# EasyEDA schematic 1-Schematic_Final Assigment.json
TITLE: Sheet_1; REV: 1.0; Date: 2020-05-26; Sheet: 1/1; Drawn By: Lachlan_C; Company: Your Company
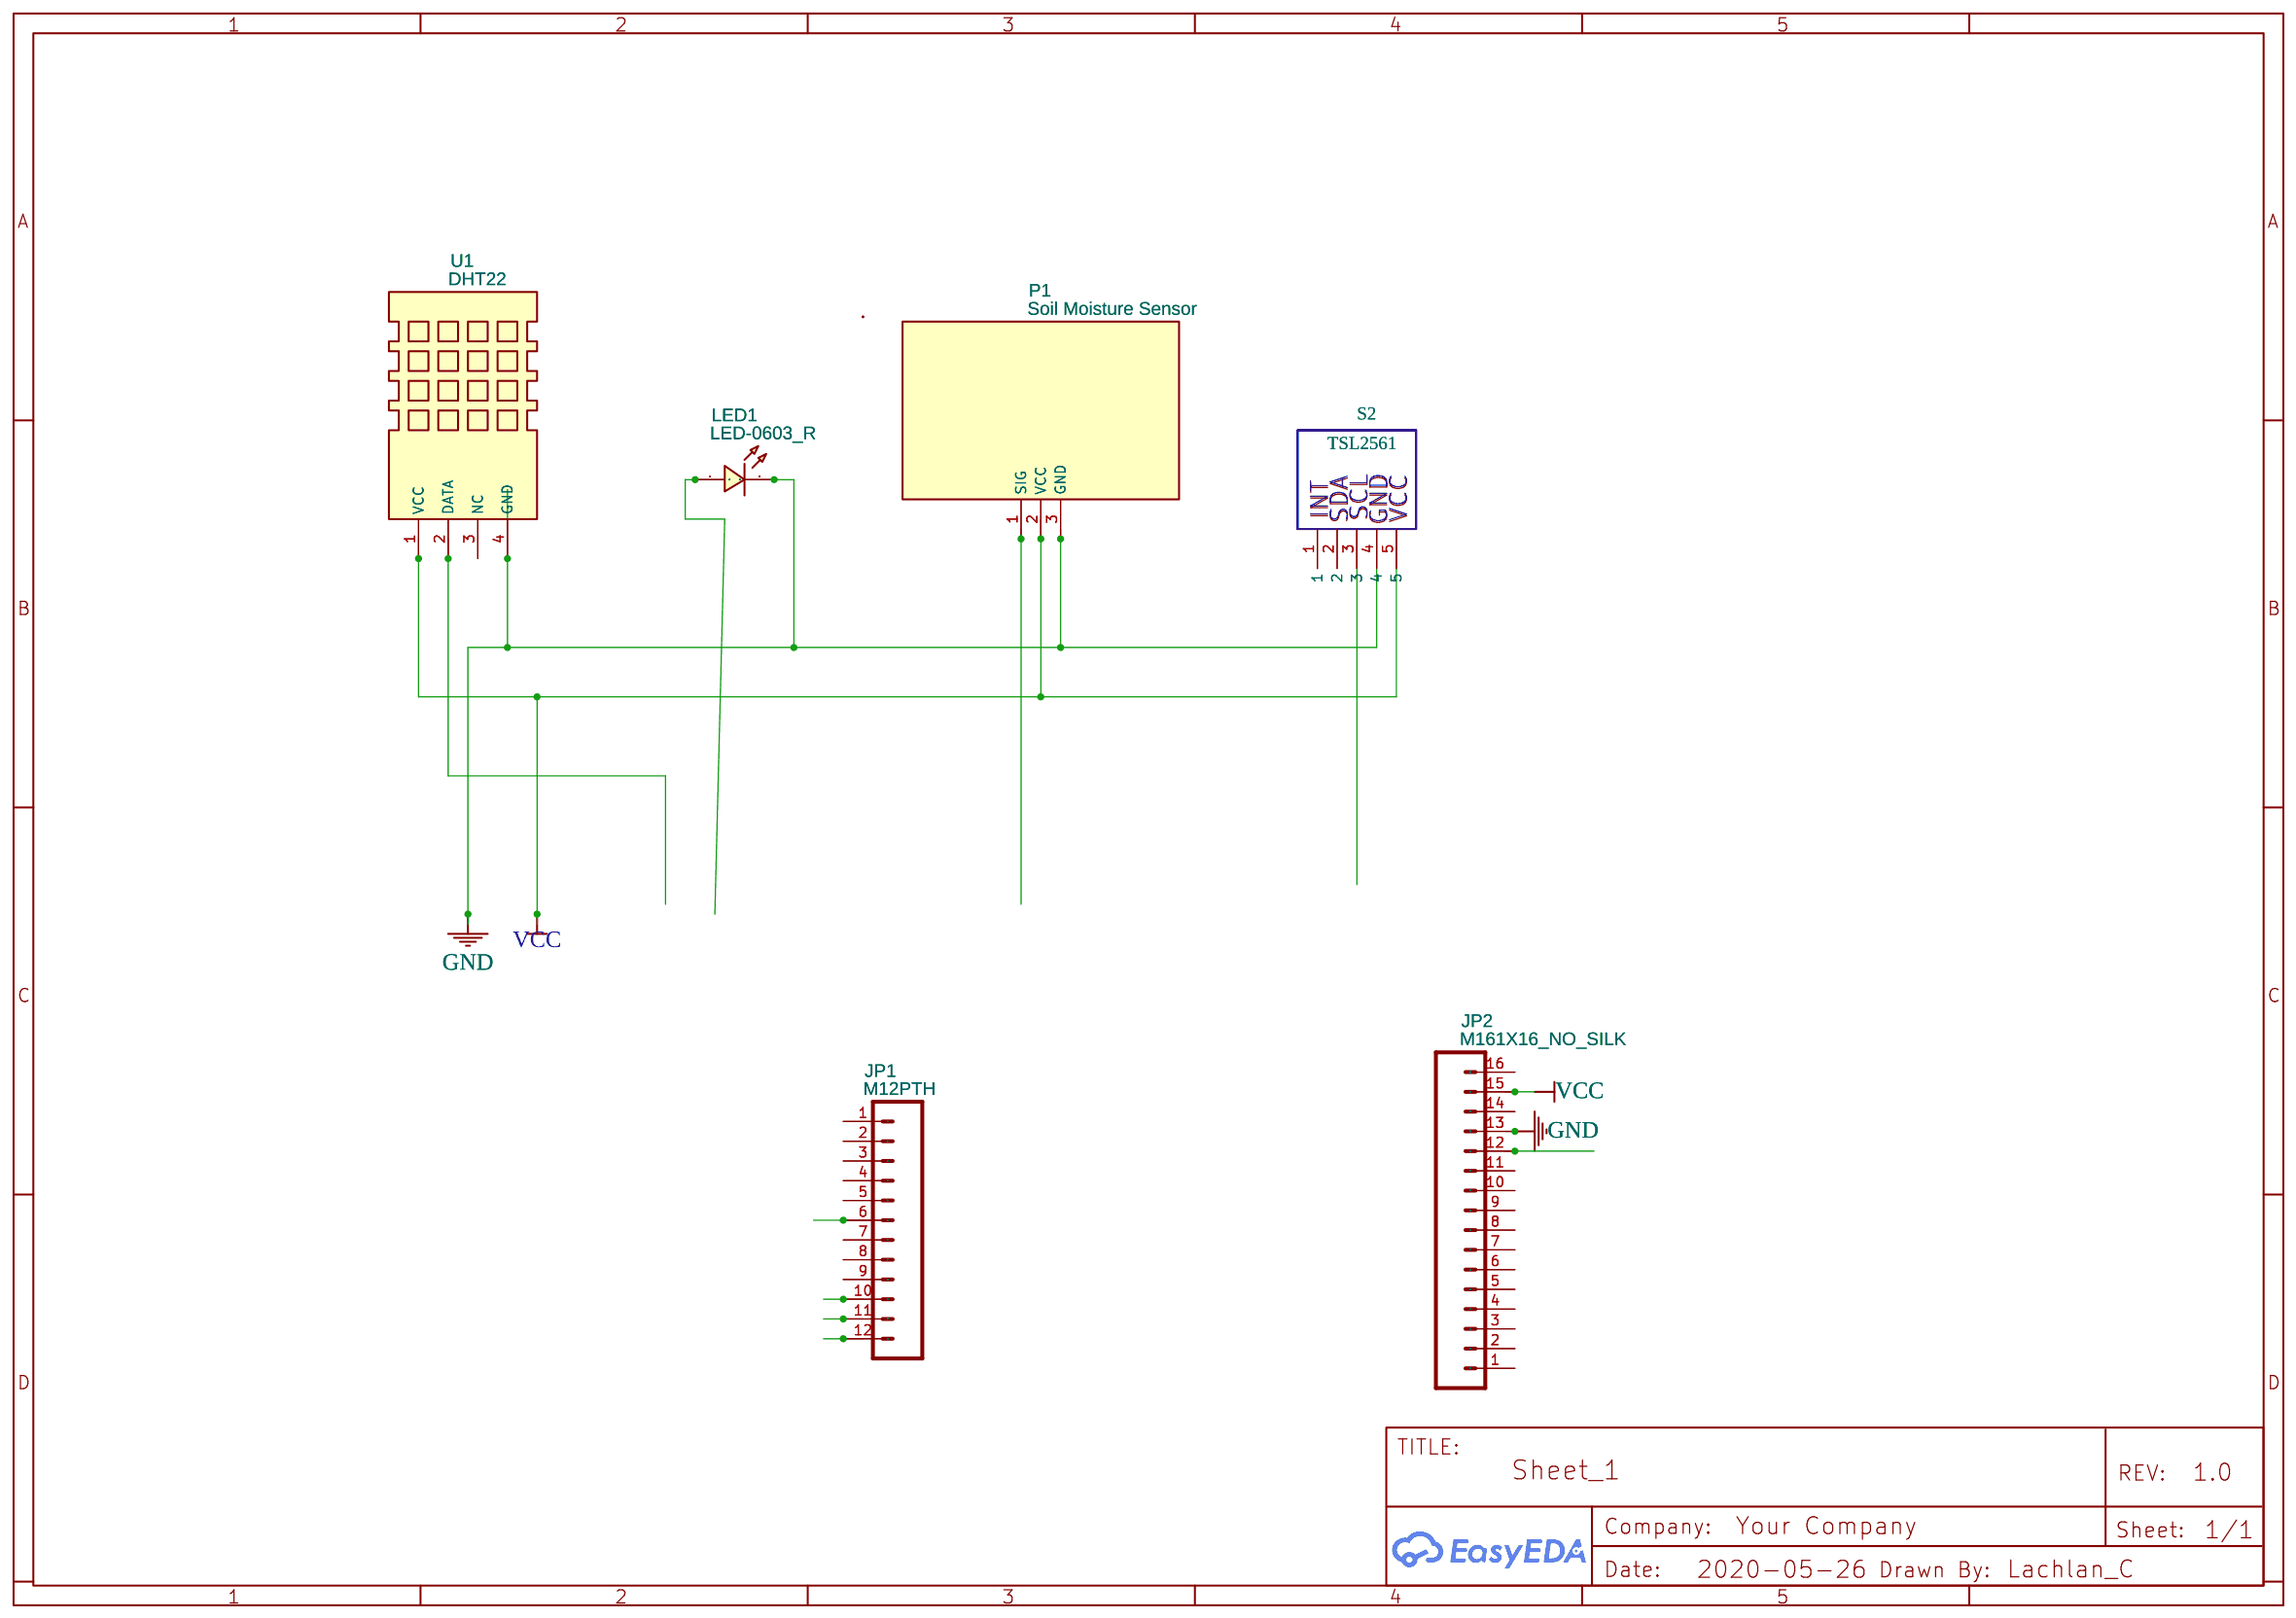
[diagram p0: schematic sheet]

## Parts
JP1  M12PTH  [1X12]
JP2  M161X16_NO_SILK  [1X16_NO_SILK]
LED1  LED-0603_R  [LED0603_RED]
P1  Soil Moisture Sensor  [SOIL MOISTURE SENSOR]
S2  TSL2561  [ADAFRUIT VEML7700 AMBIENT LIGHT SENSOR]
U1  DHT22  [DHT22_AM2303_VERT]

## Library data of the parts
JP1 = M12PTH: Header 12; Contributor: SparkFun
JP2 = M161X16_NO_SILK: 1x16 .1 header; Contributor: SparkFun
LED1 = LED-0603_R: Manufacturer: EVERLIGHT(台湾亿光); Manufacturer Part: 19-217/R6C-AL1M2VY/3T; Supplier Part: C72044; Supplier: LCSC; Contributor: LCEDA_01
P1 = Soil Moisture Sensor: sourceId: i6oizRL3l; Supplier Part: 12587; Supplier: SparkFun
U1 = DHT22: Digital-output relative humidity & temperature sensor/module; sourceId: GkiDrp9vf; Supplier Part: PRODUCT ID: 385; Supplier: AdaFruit; Voltage: 3.3V - 5.5V; Mounted: Yes; Manufacturer: Aosong (Guangzhou) Electronics Co., Ltd.; link: https://cdn-shop.adafruit.com/datasheets/DHT22.pdf

## Nets
GND: JP2.13 LED1.2 P1.3(GND) S2.4 U1.4(GND)
VCC: JP2.15 P1.2(VCC) S2.5 U1.1(VCC)

Not connected (* = marked no-connect by the designer): JP1 1 2 3 4 5 6 7 8 9 10 11 12; JP2 1 2 3 4 5 6 7 8 9 10 11 12 14 16; LED1 1; P1 1(SIG); S2 1 2 3; U1 2(DATA) 3(NC)

## Notes on the sheet
- INT
- SDA
- SCL
- GND
- VCC
